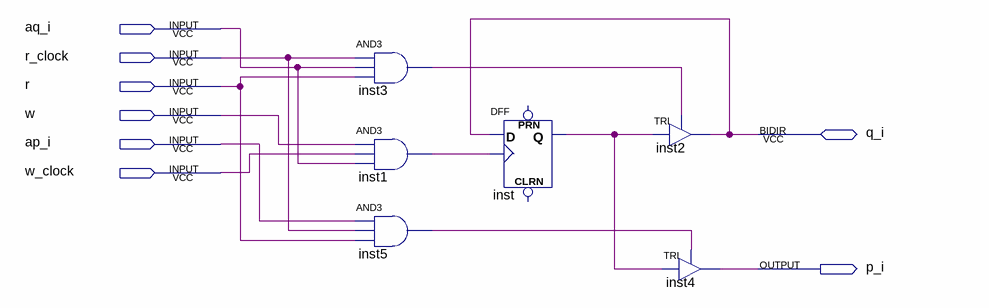
[diagram p0: schematic sheet]
// Quartus schematic fm_i.bdf as structural Verilog: 6 symbols, 8 pins
module fm_i (
  input  aq_i,
  input  r_clock,
  input  r,
  input  w,
  input  ap_i,
  input  w_clock,
  inout  q_i,
  output p_i
);

  wire inst1_out, inst3_out, inst5_out, inst_q;

  and inst3 (inst3_out, r_clock, aq_i, r);
  and inst1 (inst1_out, w, w_clock, aq_i);
  and inst5 (inst5_out, ap_i, r_clock, r);
  DFF inst (.CLK(inst1_out), .D(q_i), .Q(inst_q));  // open: CLRN, PRN
  TRI inst2 (.IN(inst_q), .OE(inst3_out), .OUT(q_i));
  TRI inst4 (.IN(inst_q), .OE(inst5_out), .OUT(p_i));
endmodule
